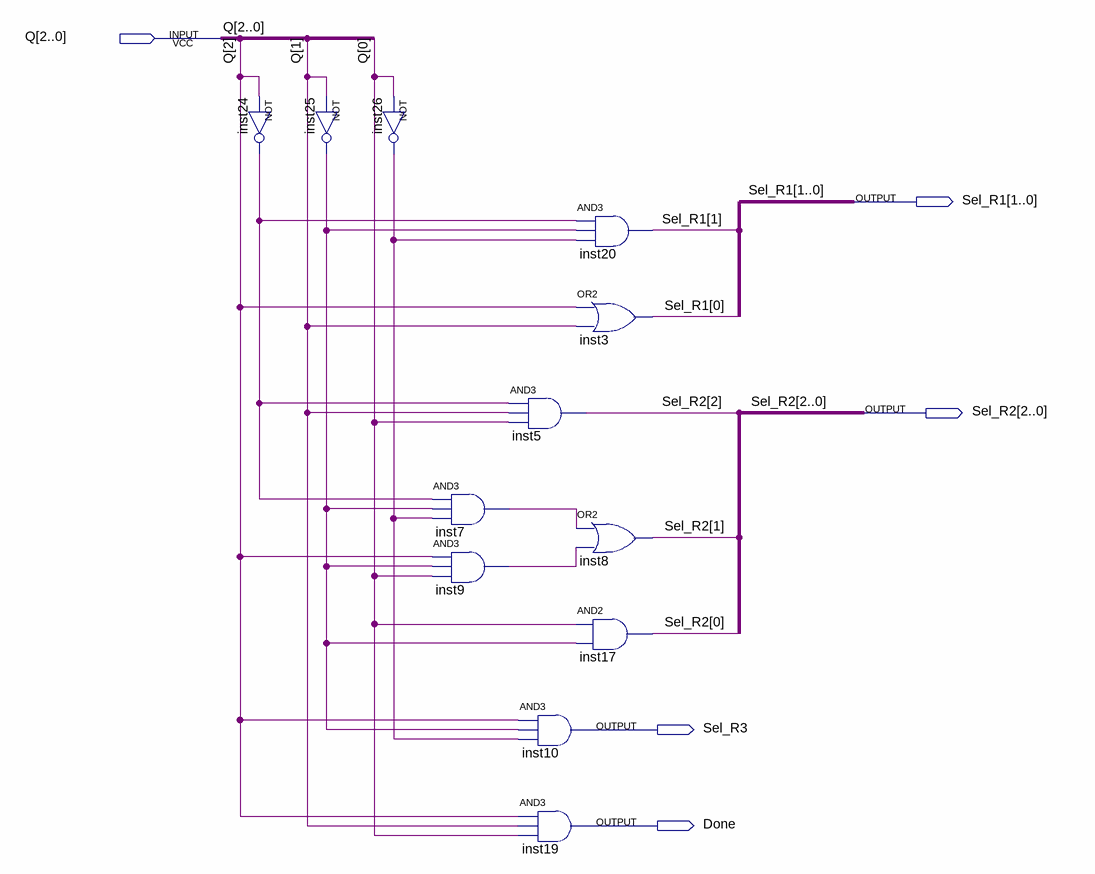
[diagram p0: schematic sheet]
// Quartus schematic Logic_output.bdf as structural Verilog: 12 symbols, 5 pins
module Logic_output (
  input  [2:0] Q,
  output [1:0] Sel_R1,
  output [2:0] Sel_R2,
  output Sel_R3,
  output Done
);

  wire inst7_out, inst9_out, inst24_out, inst25_out, inst26_out;

  not inst24 (inst24_out, Q[2]);
  not inst25 (inst25_out, Q[1]);
  not inst26 (inst26_out, Q[0]);
  and inst7 (inst7_out, inst24_out, inst25_out, inst26_out);
  and inst9 (inst9_out, Q[2], inst25_out, Q[0]);
  and inst5 (Sel_R2[2], inst24_out, Q[1], Q[0]);
  and inst20 (Sel_R1[1], inst24_out, inst25_out, inst26_out);
  or inst3 (Sel_R1[0], Q[2], Q[1]);
  or inst8 (Sel_R2[1], inst7_out, inst9_out);
  and inst17 (Sel_R2[0], Q[0], inst25_out);
  and inst10 (Sel_R3, Q[2], inst25_out, inst26_out);
  and inst19 (Done, Q[2], Q[1], Q[0]);
endmodule
